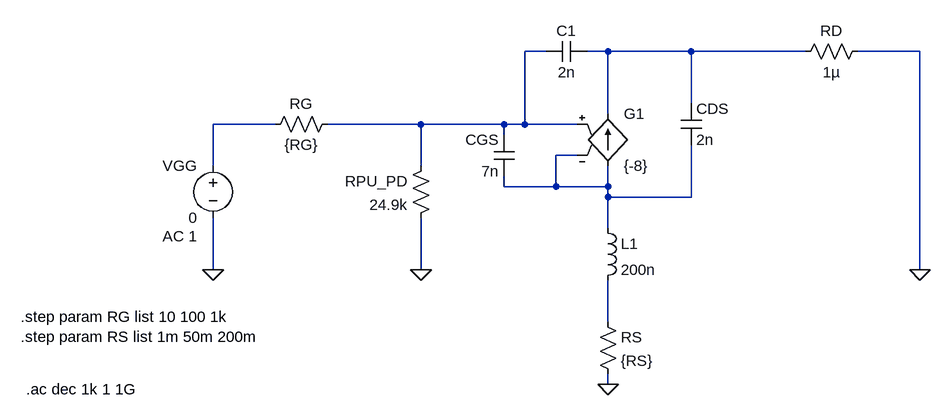
[diagram p0: schematic AC_Test_Bench.asc]
AC_Test_Bench.asc, the LTspice schematic file:
Version 4
SHEET 1 880 680
WIRE 176 -16 144 -16
WIRE 272 -16 240 -16
WIRE 400 -16 272 -16
WIRE 576 -16 400 -16
WIRE 752 -16 656 -16
WIRE 400 64 400 -16
WIRE 272 80 272 -16
WIRE -240 96 -336 96
WIRE -16 96 -160 96
WIRE 112 96 -16 96
WIRE 144 96 144 -16
WIRE 144 96 112 96
WIRE 224 96 144 96
WIRE 112 112 112 96
WIRE 224 144 192 144
WIRE -336 160 -336 96
WIRE -16 160 -16 96
WIRE 112 192 112 176
WIRE 192 192 192 144
WIRE 192 192 112 192
WIRE 272 192 272 160
WIRE 272 192 192 192
WIRE 272 208 272 192
WIRE 400 208 400 128
WIRE 400 208 272 208
WIRE 272 256 272 208
WIRE -336 320 -336 240
WIRE -16 320 -16 240
WIRE 752 320 752 -16
WIRE 272 400 272 336
WIRE 272 496 272 480
FLAG 752 320 0
FLAG 272 496 0
FLAG -336 320 0
FLAG -16 320 0
SYMBOL g 272 64 R0
SYMATTR InstName G1
SYMATTR Value {-8}
SYMBOL res 256 384 R0
SYMATTR InstName RS
SYMATTR Value {RS}
SYMBOL voltage -336 144 M0
WINDOW 123 24 124 Left 2
WINDOW 39 0 0 Left 0
SYMATTR InstName VGG
SYMATTR Value 0
SYMATTR Value2 AC 1
SYMBOL res 672 -32 R90
WINDOW 0 0 56 VBottom 2
WINDOW 3 32 56 VTop 2
SYMATTR InstName RD
SYMATTR Value 1µ
SYMBOL res -144 80 R90
WINDOW 0 0 56 VBottom 2
WINDOW 3 32 56 VTop 2
SYMATTR InstName RG
SYMATTR Value {RG}
SYMBOL cap 384 64 R0
SYMATTR InstName CDS
SYMATTR Value 2n
SYMBOL cap 128 176 R180
WINDOW 0 24 56 Left 2
WINDOW 3 24 8 Left 2
SYMATTR InstName CGS
SYMATTR Value 7n
SYMBOL cap 240 -32 R90
WINDOW 0 0 32 VBottom 2
WINDOW 3 32 32 VTop 2
SYMATTR InstName C1
SYMATTR Value 2n
SYMBOL ind 256 240 R0
SYMATTR InstName L1
SYMATTR Value 200n
SYMBOL res 0 144 M0
SYMATTR InstName RPU_PD
SYMATTR Value 24.9k
TEXT -632 392 Left 2 !.step param RG list 10 100 1k\n.step param RS list 1m 50m 200m
TEXT -624 504 Left 2 !.ac dec 1k 1 1G

The netlist it stands for:
* AC_Test_Bench.asc
G1 N004 N002 N001 N004 {-8}
RS N005 0 {RS}
VGG N003 0 0 AC 1
RD 0 N002 1µ
RG N001 N003 {RG}
CDS N002 N004 2n
CGS N004 N001 7n
C1 N002 N001 2n
L1 N004 N005 200n
RPU_PD N001 0 24.9k
.step param RG list 10 100 1k
.step param RS list 1m 50m 200m
.ac dec 1k 1 1G
.backanno
.end